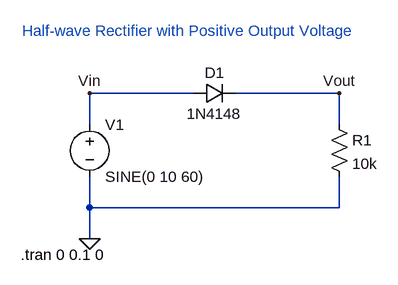
[diagram p0: schematic 2EEB_VELASCO_EXPT3_CKT1.asc]
2EEB_VELASCO_EXPT3_CKT1.asc, the LTspice schematic file:
Version 4
SHEET 1 880 680
WIRE 192 80 32 80
WIRE 416 80 256 80
WIRE 32 128 32 80
WIRE 416 128 416 80
WIRE 32 256 32 208
WIRE 416 256 416 208
WIRE 416 256 32 256
WIRE 32 304 32 256
FLAG 32 304 0
FLAG 32 80 Vin
FLAG 416 80 Vout
SYMBOL diode 192 96 R270
WINDOW 0 32 32 VTop 2
WINDOW 3 0 32 VBottom 2
SYMATTR InstName D1
SYMATTR Value 1N4148
SYMBOL res 400 112 R0
SYMATTR InstName R1
SYMATTR Value 10k
SYMBOL voltage 32 112 R0
WINDOW 123 0 0 Left 0
WINDOW 39 0 0 Left 0
SYMATTR InstName V1
SYMATTR Value SINE(0 10 60)
TEXT -72 -16 Left 2 ;Half-wave Rectifier with Positive Output Voltage
TEXT -74 328 Left 2 !.tran 0 0.1 0

The netlist it stands for:
* 2EEB_VELASCO_EXPT3_CKT1.asc
D1 Vin Vout 1N4148
R1 Vout 0 10k
V1 Vin 0 SINE(0 10 60)
.model D D
.lib standard.dio
* Half-wave Rectifier with Positive Output Voltage
.tran 0 0.1 0
.backanno
.end